# Altium schematic sheet nonets.SchDoc
size A4; SheetNumber: 5; SheetTotal: 8
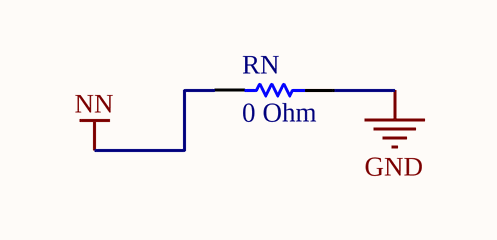
[diagram p0: nonets.SchDoc]

## Parts
RN  0 Ohm  [RESC2013X60X40ML20T25]

## Nets
GND: RN.1
NN: RN.2

## Library data of the parts
RN = CMP-2001-00580-1: Manufacturer: Panasonic; Part Number: ERA6AEB101V